# Altium schematic sheet [08]-PowerSupply.SchDoc: Powersupplies
size A3; Organization: Toradex AG; Address1: Altsagenstrasse 5; Address2: Horw; Address3: 6048; Address4: Switzerland; DocumentNumber: 7; Revision: V3.2; SheetNumber: 7; SheetTotal: 13; PageSetup: Record=PageOptions|CenterHorizontal=True|CenterVertical=True|PrintScale=0.73|XCorrection=1.00|YCorrection=1.00|PrintKind=0|BorderSize=5000000|LeftOffset=0|BottomOffset=0|Orientation=2|PaperLength=1000|PaperWidth=1000|Scale=100|PaperSource=7|PrintQuality=-4|MediaType=1|DitherType=10|PaperKind=A4|PrintScaleMode=1
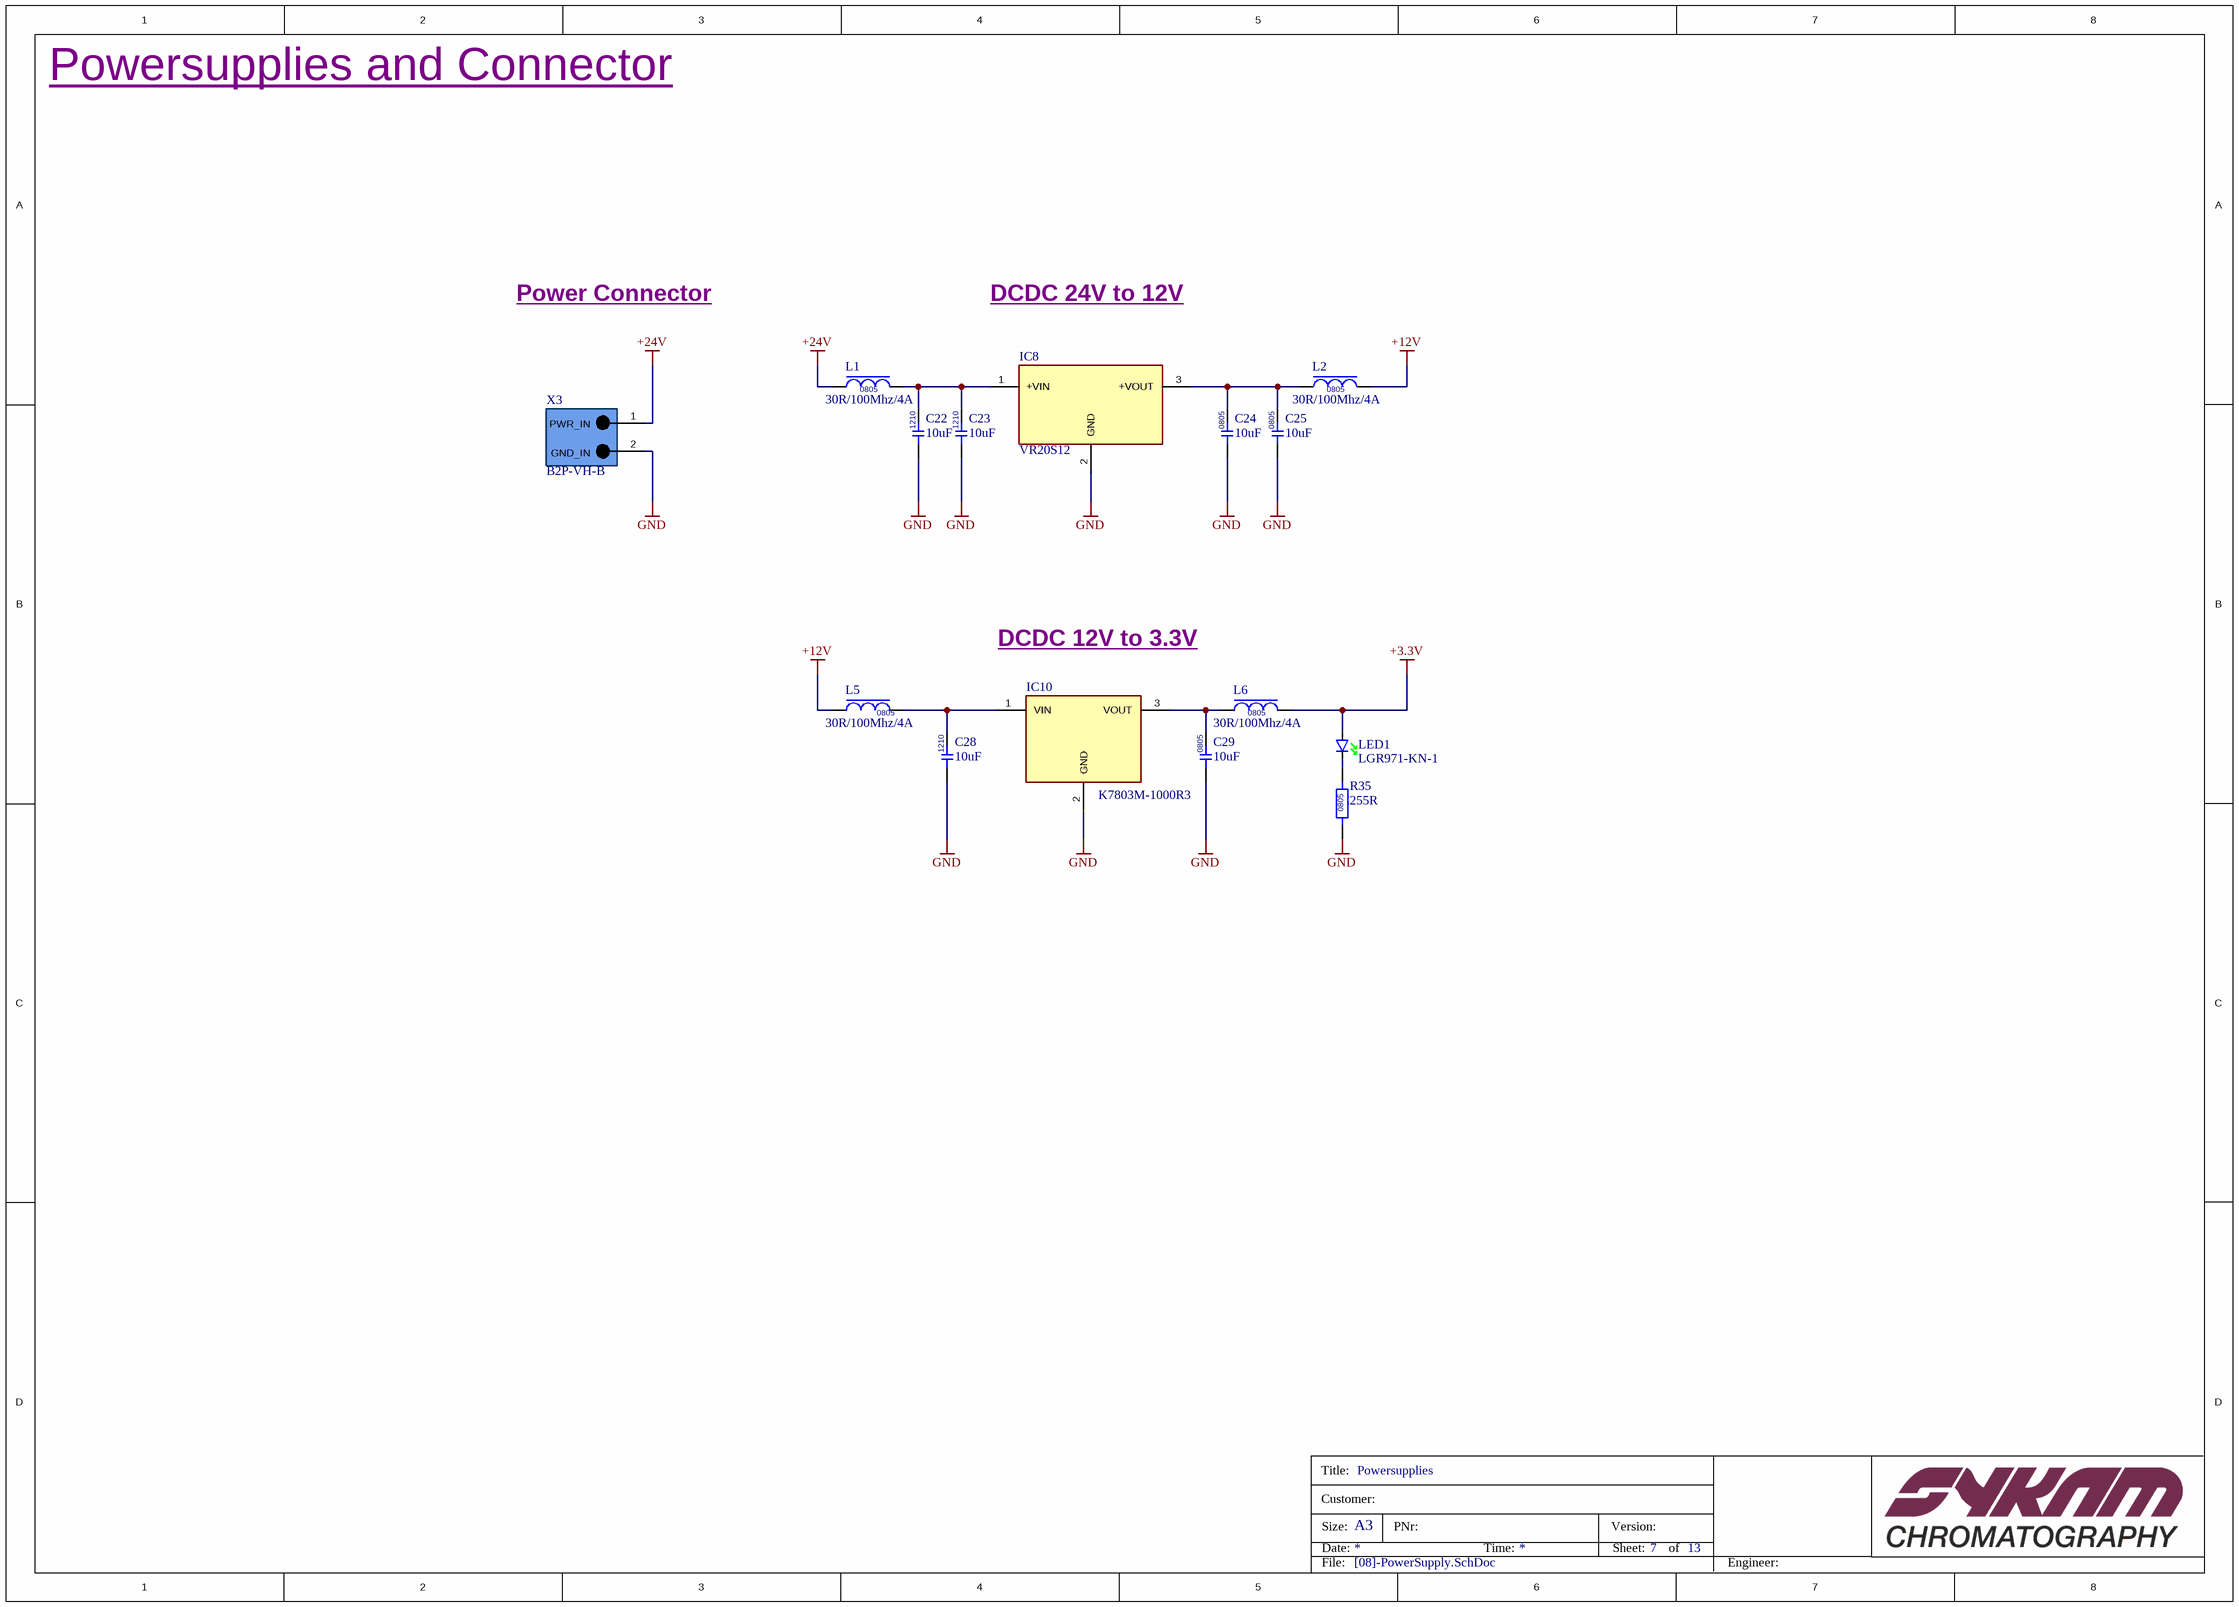
[diagram p0: [08]-PowerSupply.SchDoc]

## Parts
C22  10uF  [C1210]
C23  10uF  [C1210]
C24  10uF  [C0805]
C25  10uF  [C0805]
C28  10uF  [C1210]
C29  10uF  [C0805]
IC8  VR20S12  [IC_VR20S12_THT]
IC10  K7803M-1000R3  [IC_K7803M-1000R3_THT]
L1  30R/100Mhz/4A  [L0805]
L2  30R/100Mhz/4A  [L0805]
L5  30R/100Mhz/4A  [L0805]
L6  30R/100Mhz/4A  [L0805]
LED1  LGR971-KN-1  [LED0805]
R35  255R  [R0805]
X3  B2P-VH-B  [CON-B2P-VH-B-3.96MM_nn]

## Nets
+3.3V: L6.2 LED1.2A(A)
+12V: L2.2 L5.2
+24V: L1.1 X3.1(GND_IN)
GND: C22.1 C23.1 C24.1 C25.1 C28.1 C29.1 IC8.2(GND) IC10.2(GND) R35.1 X3.2(PWR_IN)
NetC22_2: C22.2 C23.2 IC8.1(+VIN) L1.2
NetC24_2: C24.2 C25.2 IC8.3(+VOUT) L2.1
NetC28_2: C28.2 IC10.1(VIN) L5.1
NetC29_2: C29.2 IC10.3(VOUT) L6.1
NetLED1_1K: LED1.1K(K) R35.2

## Notes on the sheet
- Powersupplies and Connector
- Power Connector
- DCDC 24V to 12V
- DCDC 12V to 3.3V
- Title:
- Customer:
- Size:
- Date:
- A3
- PNr:
- Time:
- Version:
- Sheet:
- of
- File:
- Engineer:
- Title
- Number:
- Revision:
- Sheet

## Library data of the parts
C22 C23 C28 = C_10uF_C1210C106K5RACTU: CAP CER 10UF 50V X7R 1210; Manufacturer: KEMET; Dielectric Material: Ceramic; Tolerance: 10%; Supplier 1: Digi-Key; Manufacturer Part Number: C1210C106K5RACTU; RoHS: Yes; Category: Ceramic Capacitors; Stock 1: 21988; Pricing 1: 1=0,90000, 10=0,66400, 100=0,45540, 500=0,36052 (USD); Mount: Surface Mount; Case/Package: 1210; Weight: 0.000564oz; Case Code (Metric): 3225; Case Code (Imperial): 1210; Min Operating Temperature: -55°C; Max Operating Temperature: 125°C; Packaging: Tape and Reel; Voltage Rating: 50V; Voltage: 50V; Dielectric: X7R; Termination: SMD/SMT; Voltage Rating (DC): 50V; Package Quantity: 1000; Capacitance: 10uF; Length: 3.2mm; Height: 2.5mm; Width: 2.5mm; Thickness: 0.11inch; Depth: 2.5mm; REACH SVHC: No SVHC; ComponentLink1URL: http://www.mouser.com/ds/2/212/KEM_C1002_X7R_SMD-357932.pdf?src-supplier=Mouser; ComponentLink1Description: http://www.mouser.com/ds/2/212/KEM_C1002_X7R_SMD-357932.pdf?src-supplier=Mouser; ComponentLink2URL: http://uk.rs-online.com/webdocs/1515/0900766b8151523b.pdf?src-supplier=RSComponents; ComponentLink2Description: http://uk.rs-online.com/webdocs/1515/0900766b8151523b.pdf?src-supplier=RSComponents; ComponentLink3URL: http://www.farnell.com/datasheets/2740742.pdf?src-supplier=Farnell; ComponentLink3Description: http://www.farnell.com/datasheets/2740742.pdf?src-supplier=Farnell; ComponentLink4URL: https://api.kemet.com/component-edge/download/datasheet/C1210C106K5RACTU.pdf?src-supplier=Digi-Key; ComponentLink4Description: https://api.kemet.com/component-edge/download/datasheet/C1210C106K5RACTU.pdf?src-supplier=Digi-Key; ComponentLink5URL: http://capacitoredge.kemet.com/capedge2/DataSheet/Datasheet-C0402C471J3GACTU.pdf?pn=C1210C106K5RACTU&src-supplier=Avnet; ComponentLink5Description: http://capacitoredge.kemet.com/capedge2/DataSheet/Datasheet-C0402C471J3GACTU.pdf?pn=C1210C106K5RACTU&src-supplier=Avnet; ComponentLink6URL: http://www.farnell.com/datasheets/2740742.pdf?src-supplier=Element14; ComponentLink6Description: http://www.farnell.com/datasheets/2740742.pdf?src-supplier=Element14; ComponentLink7URL: http://capacitoredge.kemet.com/capedge2/DataSheet/Datasheet-C1210C106K5RACTU.pdf?pn=C1210C106K5RACTU&src-supplier=Avnet; ComponentLink7Description: http://capacitoredge.kemet.com/capedge2/DataSheet/Datasheet-C1210C106K5RACTU.pdf?pn=C1210C106K5RACTU&src-supplier=Avnet; ComponentLink8URL: http://www.farnell.com/datasheets/1886292.pdf?src-supplier=Newark; ComponentLink8Description: http://www.farnell.com/datasheets/1886292.pdf?src-supplier=Newark; ComponentLink9URL: http://www.farnell.com/datasheets/2740742.pdf?src-supplier=Newark; ComponentLink9Description: http://www.farnell.com/datasheets/2740742.pdf?src-supplier=Newark; Supplier Part Number 1: 399-11629-1-ND
C24 C25 C29 = C_10uF_GRM21BR6YA106ME43L: 0805 10 uF 50 V ±20% Tolerance X5R Multilayer Ceramic Capacitor; Manufacturer: Murata; Voltage Rating: 35V; Supplier 1: Digi-Key; Manufacturer Part Number: GRM21BR6YA106ME43L; RoHS: Yes; Category: Ceramic Capacitors; Stock 1: 143980; Pricing 1: 1=0,48000, 10=0,33200, 100=0,19920, 500=0,14942, 1000=0,12617 (USD); Mount: Surface Mount; Case/Package: 0805; Weight: 0.000335oz; Case Code (Imperial): 0805; Case Code (Metric): 2012; Min Operating Temperature: -55°C; Max Operating Temperature: 85°C; Tolerance: 20%; Capacitance: 10uF; Packaging: Tape and Reel; Dielectric: X5R; Termination: SMD/SMT; Voltage Rating (DC): 35V; Package Quantity: 3000; Length: 0.079inch; Height: 1.25mm; Width: 0.049inch; Thickness: 0.057inch; ComponentLink1URL: http://www.mouser.com/ds/2/281/c02e-2905.pdf?src-supplier=Mouser; ComponentLink1Description: http://www.mouser.com/ds/2/281/c02e-2905.pdf?src-supplier=Mouser; ComponentLink2URL: http://search.murata.co.jp/Ceramy/image/img/A01X/G101/ENG/GRM21BR6YA106ME43-01.pdf?src-supplier=Digi-Key; ComponentLink2Description: http://search.murata.co.jp/Ceramy/image/img/A01X/G101/ENG/GRM21BR6YA106ME43-01.pdf?src-supplier=Digi-Key; Supplier Part Number 1: 490-10515-6-ND
IC8 = IC_VR20S12: DC-DC Converter, Switching Regulater, 2A, SIP, VR Series; Manufacturer: XP Power; Supplier 1: Farnell; Manufacturer Part Number: VR20S12; RoHS: No; Category: Board Mount Modules; Pricing 1: 1=6,07000, 5=5,88000, 10=5,70000, 20=5,46000, 50=5,10000 (EUR); Supplier Part Number 1: 3525433
IC10 = IC_K7803M-1000R3: Nichtisoliertes PoL-Modul DC/DC-Wandler 1 Ausgang 3,3V 1A 6V - 36V Eingang
L1 L2 L5 L6 = L_BLM21PG300SN1D: Ferrite Beads Multi-Layer 30Ohm 100MHz 4A 14mOhm DCR 0805 T/R; Manufacturer: Murata; Material: Steel,Ferrite; Resistance: 15mR; Tolerance: 25%; Impedance: 30R; Shielding: Unshielded; Number of Circuits: 1; DC Resistance (DCR): 14mR; Max DC Current: 3A; PCBChecked: initials after Checked; Supplier 1: Digi-Key; Manufacturer Part Number: BLM21PG300SN1D; RoHS: Yes; Category: Ferrite Beads and Chips; Case/Package: 0805; Number of Pins: 2; Core Material: Ferrite; Case Code (Metric): 2012; Case Code (Imperial): 0805; Min Operating Temperature: -55°C; Max Operating Temperature: 125°C; Frequency: 100MHz; Packaging: Tape and Reel; Package Quantity: 1; Max Current Rating: 4A; Number of Lines: 1; Termination: SMD/SMT; Test Frequency: 100MHz; DC Current: 3A; Military Standard: Not; Current Rating: 4A; Length: 2mm; Height: 0.85mm; Width: 1.25mm; Depth: 1.25mm; Radiation Hardening: No; Lead Free: Lead Free; REACH SVHC: No SVHC; ComponentLink1URL: https://datasheet.ciiva.com/11795/0900766b80021a8e-11795584.pdf?src-supplier=RSComponents; ComponentLink1Description: https://datasheet.ciiva.com/11795/0900766b80021a8e-11795584.pdf?src-supplier=RSComponents; ComponentLink2URL: https://datasheet.ciiva.com/19460/1845339-19460237.pdf?src-supplier=Jameco; ComponentLink2Description: https://datasheet.ciiva.com/19460/1845339-19460237.pdf?src-supplier=Jameco; ComponentLink3URL: https://datasheet.ciiva.com/25903/l0110s0100blm21p-25903510.pdf?src-supplier=Avnet+Europe; ComponentLink3Description: https://datasheet.ciiva.com/25903/l0110s0100blm21p-25903510.pdf?src-supplier=Avnet+Europe; ComponentLink4URL: https://datasheet.ciiva.com/3081/l0110s0100blm21p-3081657.pdf?src-supplier=Avnet; ComponentLink4Description: https://datasheet.ciiva.com/3081/l0110s0100blm21p-3081657.pdf?src-supplier=Avnet; ComponentLink5URL: https://datasheet.ciiva.com/16199/l0110s0100blm21p-16199625.pdf?src-supplier=Future+Electronics; ComponentLink5Description: https://datasheet.ciiva.com/16199/l0110s0100blm21p-16199625.pdf?src-supplier=Future+Electronics; ComponentLink6URL: https://datasheet.ciiva.com/3081/l0110s0100blm21p-3081658.pdf?src-supplier=Avnet; ComponentLink6Description: https://datasheet.ciiva.com/3081/l0110s0100blm21p-3081658.pdf?src-supplier=Avnet; ComponentLink7URL: https://datasheet.ciiva.com/6212/l0110s0100blm21p-6212358.pdf?src-supplier=Digi-Key; ComponentLink7Description: https://datasheet.ciiva.com/6212/l0110s0100blm21p-6212358.pdf?src-supplier=Digi-Key; ComponentLink8URL: https://datasheet.ciiva.com/6212/l0110s0100blm21p-6212360.pdf?src-supplier=Digi-Key; ComponentLink8Description: https://datasheet.ciiva.com/6212/l0110s0100blm21p-6212360.pdf?src-supplier=Digi-Key; ComponentLink9URL: https://datasheet.ciiva.com/8021/1756152-8021599.pdf?src-supplier=Element14; ComponentLink9Description: https://datasheet.ciiva.com/8021/1756152-8021599.pdf?src-supplier=Element14; ComponentLink10URL: https://datasheet.ciiva.com/41449/001172365-da-01-en-drossel-0805-30r0-2-0x1-25mm-4000st-41449606.pdf?src-supplier=Conrad; ComponentLink10Description: https://datasheet.ciiva.com/41449/001172365-da-01-en-drossel-0805-30r0-2-0x1-25mm-4000st-41449606.pdf?src-supplier=Conrad; Supplier Part Number 1: 490-1052-1-ND; Stock 1: 88452; IPC7352C: done; SCHChecked: Initials after checked
LED1 = LED_LGR971-KN-1: LED Uni-Color Green 572nm 2-Pin SMD T/R; Manufacturer: Osram Opto; Lens Color: White; Test Current: 20mA; Dominant Wavelength: 570nm; Lens Transparency: Diffused; Luminous Flux: 0.1lm; Number of Elements: 1; Power Dissipation: 65mW; Forward Current: 25mA; Forward Voltage: 2.2V; Lens Style: Diffused,Flat,Colorless,Rectangular; Luminous Intensity: 45mcd; Viewing Angle: 160°; Reverse Voltage: 12V; Lens Size: 1.25mm; Supplier 1: Digi-Key; Manufacturer Part Number: LGR971-KN-1; RoHS: Yes; Category: LEDs; Stock 1: 89127; Pricing 1: 1=0,26000, 10=0,19100, 100=0,09050, 500=0,06036, 1000=0,04728 (USD); Mount: Surface Mount; Case/Package: 0805; Number of Pins: 2; Case Code (Metric): 2012; Color: Green; Case Code (Imperial): 0805; Min Operating Temperature: -30°C; Max Operating Temperature: 85°C; Packaging: Tape and Reel; Package Quantity: 1; Illumination Color: Green; Number of LEDs: 1; Length: 2.1mm; Height: 0.9mm; Depth: 1.35mm; Width: 1.25mm; Radiation Hardening: No; ComponentLink1URL: https://datasheet.ciiva.com/15198/getdatasheetpartid-233880-15198360.pdf?src-supplier=Verical; ComponentLink1Description: https://datasheet.ciiva.com/15198/getdatasheetpartid-233880-15198360.pdf?src-supplier=Verical; ComponentLink2URL: https://datasheet.ciiva.com/15198/getdatasheetpartid-462214-15198395.pdf?src-supplier=Verical; ComponentLink2Description: https://datasheet.ciiva.com/15198/getdatasheetpartid-462214-15198395.pdf?src-supplier=Verical; ComponentLink3URL: https://datasheet.ciiva.com/4688/g-r971-221296-4688589.pdf?src-supplier=Mouser; ComponentLink3Description: https://datasheet.ciiva.com/4688/g-r971-221296-4688589.pdf?src-supplier=Mouser; ComponentLink4URL: https://datasheet.ciiva.com/14918/00078860-0-14918604.pdf?src-supplier=Digi-Key; ComponentLink4Description: https://datasheet.ciiva.com/14918/00078860-0-14918604.pdf?src-supplier=Digi-Key; ComponentLink5URL: https://datasheet.ciiva.com/14918/00078860-0-14918605.pdf?src-supplier=Digi-Key; ComponentLink5Description: https://datasheet.ciiva.com/14918/00078860-0-14918605.pdf?src-supplier=Digi-Key; ComponentLink6URL: https://datasheet.ciiva.com/14918/00078860-0-14918606.pdf?src-supplier=Digi-Key; ComponentLink6Description: https://datasheet.ciiva.com/14918/00078860-0-14918606.pdf?src-supplier=Digi-Key; Supplier Part Number 1: 475-1410-1-ND
R35 = R_255R_RC0805FR-07255RL: Res Thick Film 0805 255 Ohm 1% 0.125W(1/8W) ±100ppm/C Epoxy SMD T/R; Manufacturer: Yageo; Power Rating: 125mW; Voltage Rating: 150V; Temperature Coefficient: 100ppm/°C; Manufacturer Part Number: RC0805FR-07255RL; RoHS: Yes; Category: Chip SMD Resistors; Stock 1: 5010; Pricing 1: 1=0,10000, 10=0,04000, 100=0,01630, 1000=0,00731, 2500=0,00635 (USD); Case/Package: 0805; Case Code (Metric): 2012; Case Code (Imperial): 0805; Contact Plating: Tin,Matte; Min Operating Temperature: -55°C; Max Operating Temperature: 155°C; Package Quantity: 1; Resistance: 255R; Tolerance: 1%; Packaging: Tape and Reel; Composition: Thick Film; Termination: SMD/SMT; Voltage Rating (DC): 150V; Number of Terminations: 2; Military Standard: Not; Max Power Dissipation: 125mW; Features: Moisture Resistant; Length: 2mm; Height: 0.024inch; Width: 0.049inch; Depth: 1.25mm; Radiation Hardening: No; Lead Free: Lead Free; ComponentLink1URL: https://datasheet.ciiva.com/2457/pyu-r-int-thick-7-2457200.pdf?src-supplier=Digi-Key; ComponentLink1Description: https://datasheet.ciiva.com/2457/pyu-r-int-thick-7-2457200.pdf?src-supplier=Digi-Key; ComponentLink2URL: https://datasheet.ciiva.com/2457/pyu-r-int-thick-7-2457201.pdf?src-supplier=Digi-Key; ComponentLink2Description: https://datasheet.ciiva.com/2457/pyu-r-int-thick-7-2457201.pdf?src-supplier=Digi-Key; ComponentLink3URL: https://datasheet.ciiva.com/2457/pyu-r-int-thick-7-2457202.pdf?src-supplier=Digi-Key; ComponentLink3Description: https://datasheet.ciiva.com/2457/pyu-r-int-thick-7-2457202.pdf?src-supplier=Digi-Key; Supplier 1: Digi-Key; Supplier Part Number 1: 541-255CCT-ND
X3 = CON_2p_B2P-VH-B(LF)(SN): CONN HEADER TOP 2POS 3.96MM VH; Manufacturer: JST; Number of Positions: 2; Connector Type: Male Pin; Pitch: 0.156inch; PCBChecked: initials after Checked; Supplier 1: RSComponents; Manufacturer Part Number: B2P-VH-B(LF)(SN); RoHS: Yes; Category: Connectors; Mount: Through Hole; Color: Natural; Contact Plating: Tin; Termination: Solder; Number of Rows: 1; Fastening Type: Friction,Ramp; Packaging: Bulk; Contact Mating Length: 0.303inch; Lead Free: Lead Free; ComponentLink1URL: https://datasheet.ciiva.com/6853/evh-6853485.pdf?src-supplier=Digi-Key; ComponentLink1Description: https://datasheet.ciiva.com/6853/evh-6853485.pdf?src-supplier=Digi-Key; ComponentLink2URL: https://datasheet.ciiva.com/16358/b2p-vh-blfsn-16358717.pdf?src-supplier=Future+Electronics; ComponentLink2Description: https://datasheet.ciiva.com/16358/b2p-vh-blfsn-16358717.pdf?src-supplier=Future+Electronics; Supplier Part Number 1: 7495193; Pricing 1: 50=0,19300, 500=0,16400, 1250=0,15500, 2500=0,14500, 5000=0,13500 (EUR); IPC7352C: initials after Checked; SCHChecked: initials after Checked